# Altium schematic sheet pwm2can.SchDoc
size A4
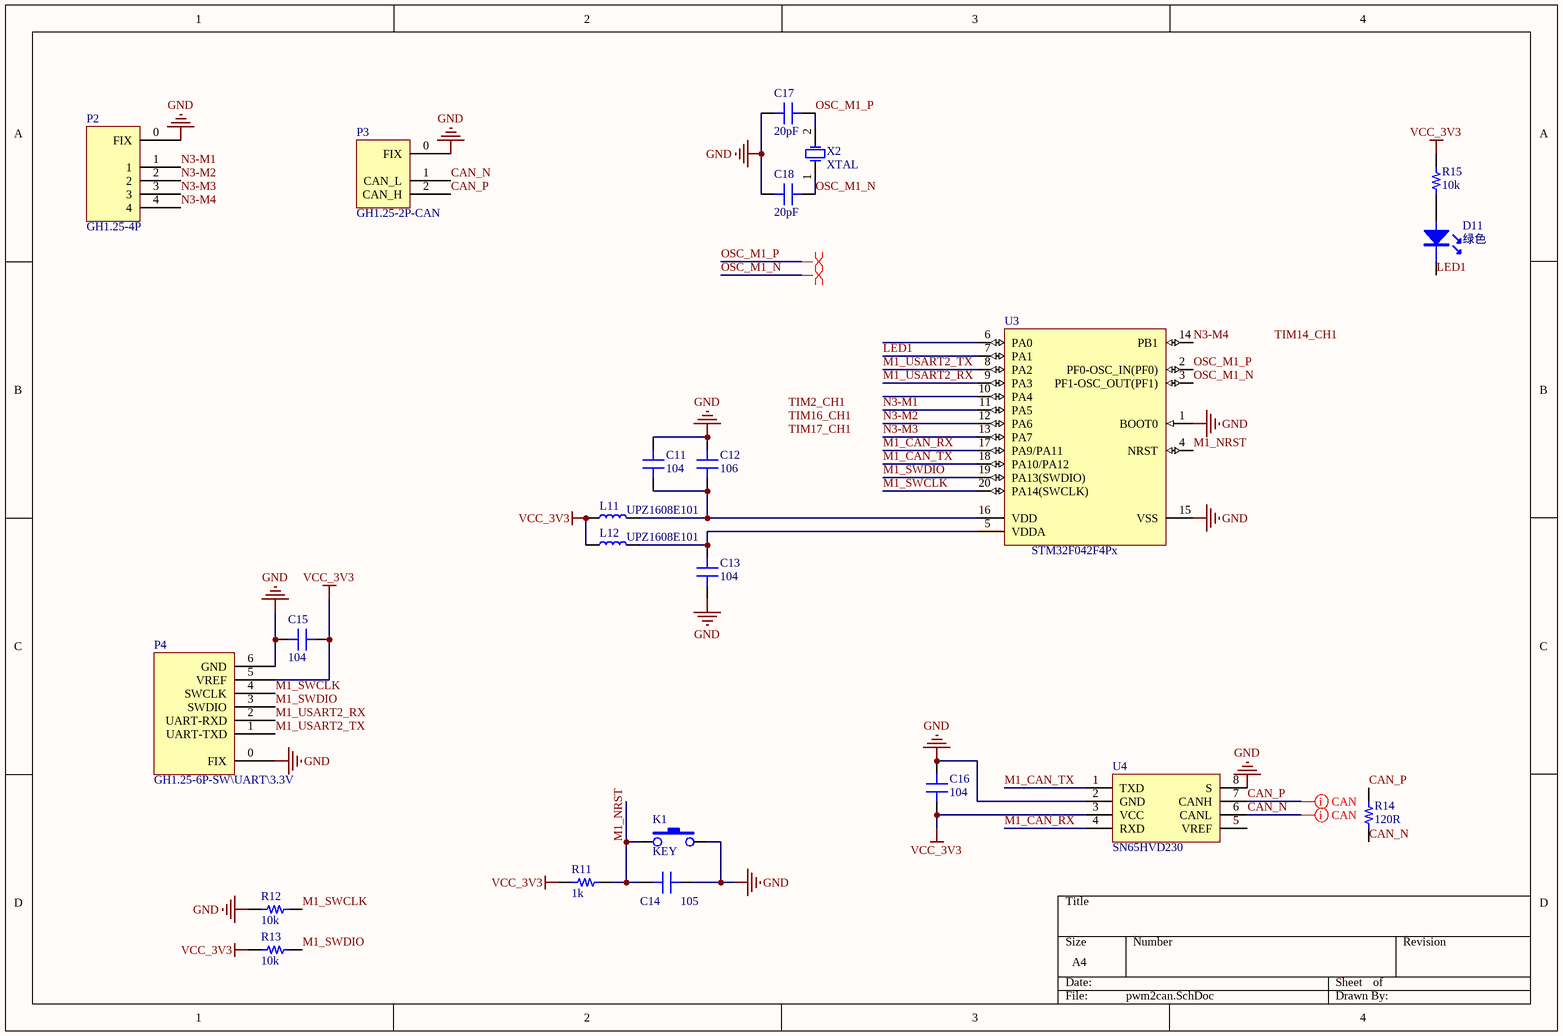
[diagram p0: pwm2can.SchDoc]

## Parts
C11  104  [C0603/1608]
C12  106  [C0603/1608]
C13  104  [C0603/1608]
C14  105  [C0603/1608]
C15  104  [C0603/1608]
C16  104  [C0603/1608]
C17  20pF  [C0603/1608]
C18  20pF  [C0603/1608]
D11  Color: 绿色  [LED0603-蓝色]  (hidden comment: LED-绿色)
K1  KEY  [按键（2脚）]
L11  UPZ1608E101  [L0603/1608]
L12  UPZ1608E101  [L0603/1608]
P2  GH1.25-4P  [GH1.25-4P（卧贴）]
P3  GH1.25-2P-CAN  [GH1.25-2P（卧贴）]
P4  GH1.25-6P-SW\UART\3.3V  [GH1.25-6P（立贴）]
R11  1k  [R0603/1608]
R12  10k  [R0603/1608]
R13  10k  [R0603/1608]
R14  120R  [R0603/1608]
R15  10k  [R0603/1608]
U3  STM32F042F4Px  [TSSOP20]
U4  SN65HVD230  [SOP-8]
X2  XTAL  [XTAL-49S]

## Nets
GND: C11.1 C12.1 C13.1 C14.1 C15.2 C16.2 C17.2 C18.2 K1.2 P2.0(FIX) P3.0(FIX) P4.0(FIX) P4.6(GND) R12.1 U3.1(BOOT0) U3.15(VSS) U4.2(GND) U4.8(S)
VCC_3V3: C15.1 C16.1 L11.1 L12.1 P4.5(VREF) R11.1 R13.1 R15.2 U4.3(VCC)
CAN_N: P3.1(CAN_L) R14.1 U4.6(CANL)
CAN_P: P3.2(CAN_H) R14.2 U4.7(CANH)
LED1: D11.2(K) U3.7(PA1)
M1_CAN_RX: U3.17(PA9/PA11) U4.4(RXD)
M1_CAN_TX: U3.18(PA10/PA12) U4.1(TXD)
M1_NRST: C14.2 K1.1 R11.2 U3.4(NRST)
M1_SWCLK: P4.4(SWCLK) R12.2 U3.20(PA14(SWCLK))
M1_SWDIO: P4.3(SWDIO) R13.2 U3.19(PA13(SWDIO))
M1_USART2_RX: P4.2(UART-RXD) U3.9(PA3)
M1_USART2_TX: P4.1(UART-TXD) U3.8(PA2)
N3-M1: P2.1 U3.11(PA5)
N3-M2: P2.2 U3.12(PA6)
N3-M3: P2.3 U3.13(PA7)
N3-M4: P2.4 U3.14(PB1)
OSC_M1_N: C18.1 U3.3(PF1-OSC_OUT(PF1)) X2.1(OSC1)
OSC_M1_P: C17.1 U3.2(PF0-OSC_IN(PF0)) X2.2(OSC2)
NetC11_2: C11.2 C12.2 L11.2 U3.16(VDD)
NetC13_2: C13.2 L12.2 U3.5(VDDA)
NetD11_1: D11.1(A) R15.1

Not connected (* = marked no-connect by the designer): U3 6(PA0) 10(PA4); U4 5(VREF)

## Layout directives
differential pair: CAN_N, CAN_P, OSC_M1_N, OSC_M1_P

## Notes on the sheet
- Labels drawn without touching a wire or pin: TIM2_CH1, TIM14_CH1, TIM16_CH1, TIM17_CH1

## Library data of the parts
C11-C18 = 陶瓷电容
D11 = LED: 发光二极管
K1 = 按键（2脚）: 按键-2脚贴片
L11 L12 = 磁珠: 贴片磁珠
P2 = GH1.25-4P: GH1.25-4P-CAN\5V
R11-R15 = 电阻
U4 = SN65HVD230: CAN收发芯片
X2 = 晶振: Published: 8-Jun-2000; LatestRevisionDate: 17-Jul-2002; LatestRevisionNote: Re-released for DXP Platform.; Publisher: Altium Limited